# Altium schematic sheet Regulator 3.3V.SchDoc
size A; SheetNumber: 2; SheetTotal: 14
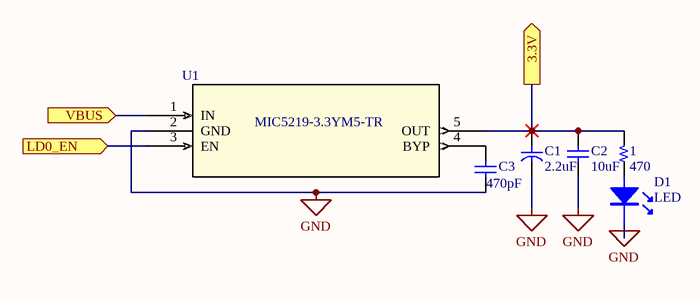
[diagram p0: Regulator 3.3V.SchDoc]

## Parts
1  470  [R 0805]
C1  2.2uF  [C SMD TAN 1206 (A)]
C2  10uF  [C 0805]
C3  470pF  [C 0805]
D1  LED  [CAP10UF]
U1  MIC5219-3.3YM5-TR  [SOT-23-5_M5_MCH]

## Ports
3.3V (out, see ESP32[4A], Ecternal I2C[2B], MLX Sensor[2B], Navigation switches[2B], Programming Circuit[2B], SD card[3B]), LD0_EN (in, see ESP32[3A], On-Off Switch[1B]), VBUS (in, see ESP32[3A], Battery Charging[3B], On-Off Switch[2A], USB Input[3B])

## Nets
GND: C1.2 C2.2 C3.2 D1.2 U1.2(GND)
3.3V: 1.2 C1.1 C2.1 U1.5(OUT) ; port 3.3V
LD0_EN: U1.3(EN) ; port LD0_EN
VBUS: U1.1(IN) ; port VBUS
NetC3_1: C3.1 U1.4(BYP)

Not connected (* = marked no-connect by the designer): 1 1; D1 1

## Library data of the parts
1 = Resistor
C1 = Capacitor: Capacitor pol
C2 C3 = Capacitor NP: Capacitor non-pol
U1 = MIC5219-3.3YM5-TR: No Description Available; Mfr_Name: Microchip; RefDes: RefDes; Type: Type